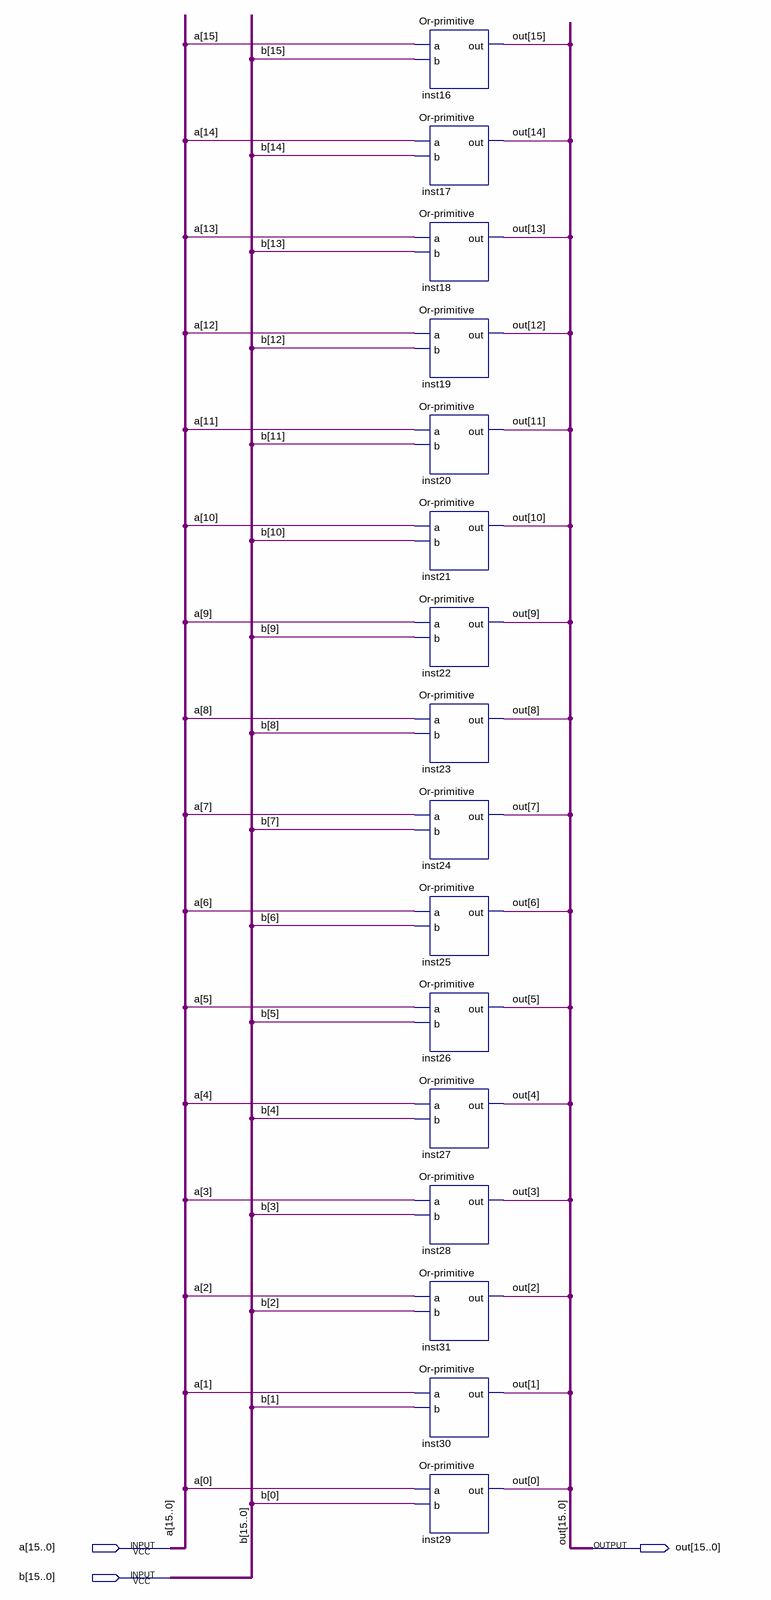
[diagram p0: schematic sheet]
// Quartus schematic Or16.bdf as structural Verilog: 16 symbols, 3 pins
module Or16 (
  input  [15:0] a,
  input  [15:0] b,
  output [15:0] out
);

  \Or-primitive  inst16 (.a(a[15]), .b(b[15]), .out(out[15]));
  \Or-primitive  inst17 (.a(a[14]), .b(b[14]), .out(out[14]));
  \Or-primitive  inst18 (.a(a[13]), .b(b[13]), .out(out[13]));
  \Or-primitive  inst19 (.a(a[12]), .b(b[12]), .out(out[12]));
  \Or-primitive  inst20 (.a(a[11]), .b(b[11]), .out(out[11]));
  \Or-primitive  inst21 (.a(a[10]), .b(b[10]), .out(out[10]));
  \Or-primitive  inst22 (.a(a[9]), .b(b[9]), .out(out[9]));
  \Or-primitive  inst23 (.a(a[8]), .b(b[8]), .out(out[8]));
  \Or-primitive  inst24 (.a(a[7]), .b(b[7]), .out(out[7]));
  \Or-primitive  inst25 (.a(a[6]), .b(b[6]), .out(out[6]));
  \Or-primitive  inst26 (.a(a[5]), .b(b[5]), .out(out[5]));
  \Or-primitive  inst27 (.a(a[4]), .b(b[4]), .out(out[4]));
  \Or-primitive  inst28 (.a(a[3]), .b(b[3]), .out(out[3]));
  \Or-primitive  inst31 (.a(a[2]), .b(b[2]), .out(out[2]));
  \Or-primitive  inst30 (.a(a[1]), .b(b[1]), .out(out[1]));
  \Or-primitive  inst29 (.a(a[0]), .b(b[0]), .out(out[0]));
endmodule
